# EAGLE schematic Sim7600 interface (EAGLE 9.6.2)
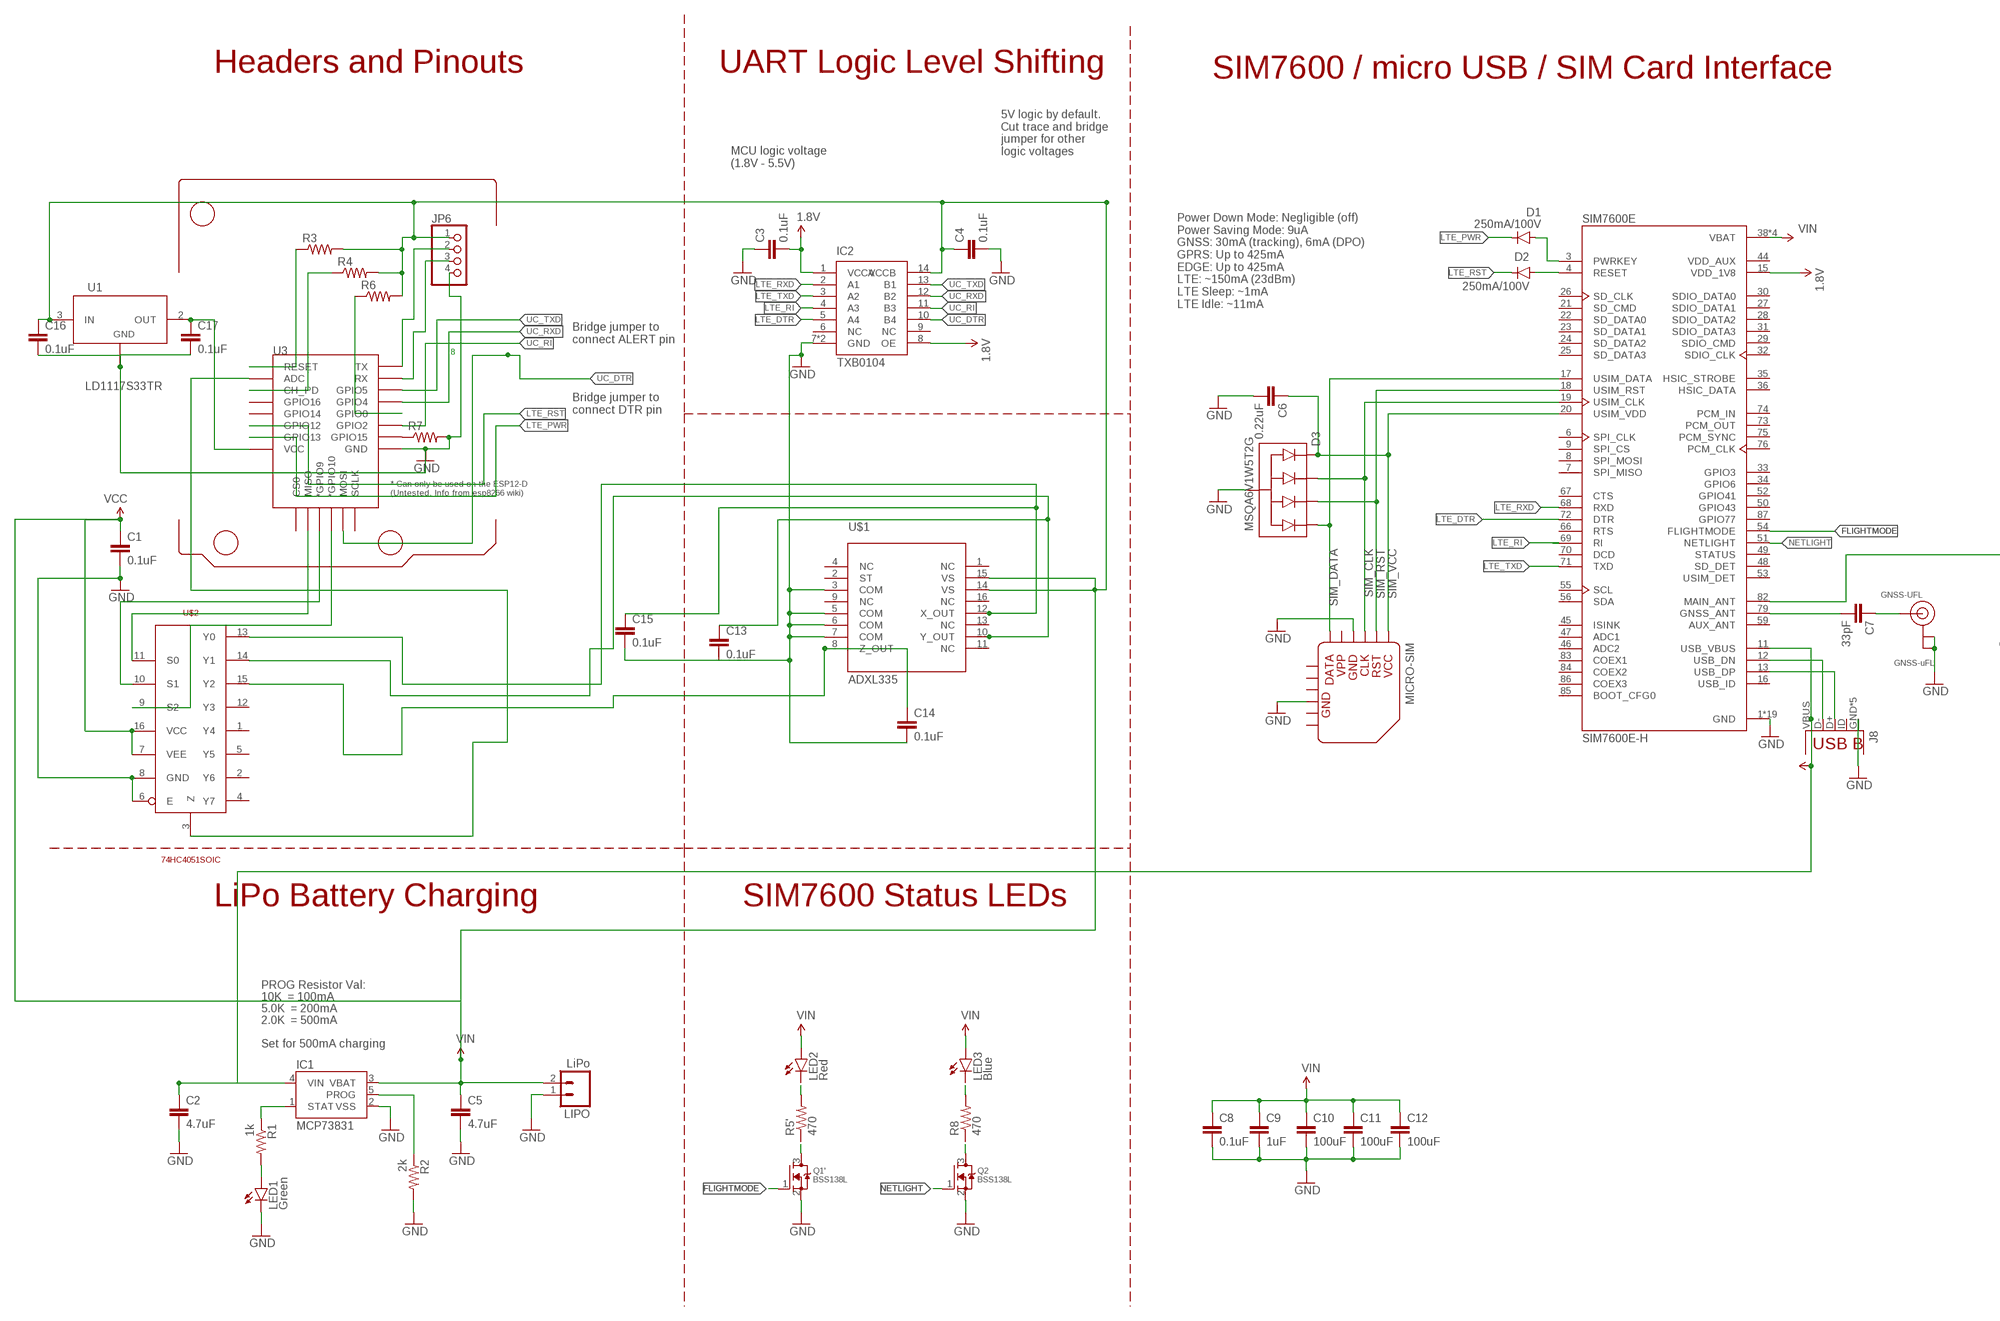
[diagram p0: schematic, sheet 1, part 1 of 2]
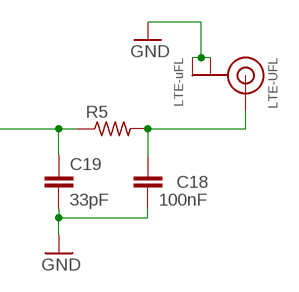
[diagram p1: schematic, sheet 1, part 2 of 2]

## Parts
C1  0.1uF  0.1UF-0603-25V-(+80/-20%)  [0603]
C2  4.7uF  CAPMARKED-0603  [0603-CAP-MARKED]
C3  0.1uF  CAPMARKED-0603  [0603-CAP-MARKED]
C4  0.1uF  CAPMARKED-0603  [0603-CAP-MARKED]
C5  4.7uF  CAPMARKED-0603  [0603-CAP-MARKED]
C6  0.22uF  CAPMARKED-0603  [0603-CAP-MARKED]
C7  33pF  CAPMARKED-0603  [0603-CAP-MARKED]
C8  0.1uF  CAPMARKED-0603  [0603-CAP-MARKED]
C9  1uF  CAPMARKED-0603  [0603-CAP-MARKED]
C10  100uF  CAPMARKED-1210  [1210]
C11  100uF  CAPMARKED-1210  [1210]
C12  100uF  CAPMARKED-1210  [1210]
C13  0.1uF  CAPMARKED-0603  [0603-CAP-MARKED]
C14  0.1uF  CAPMARKED-0603  [0603-CAP-MARKED]
C15  0.1uF  CAPMARKED-0603  [0603-CAP-MARKED]
C16  0.1uF  0.1UF-0603-25V-(+80/-20%)  [0603]
C17  0.1uF  0.1UF-0603-25V-(+80/-20%)  [0603]
C18  100nF  CAPMARKED-0603  [0603-CAP-MARKED]
C19  33pF  CAPMARKED-0603  [0603-CAP-MARKED]
D1  250mA/100V  DIODESOD323  [SOD-323]
D2  250mA/100V  DIODESOD323  [SOD-323]
D3  MSQA6V1W5T2G  TVS-DIODE-ARRAY-4X  [SOT-353]
GNSS-UFL  GNSS-uFL  ANTENNA_U.FL  [U.FL]
IC1  MCP73831  [SOT23-5]
IC2  TXB0104  LEVEL_SHIFTER_TXB0104TXB0104RGYR  [VQFN-14]
J8  microUSB  MICRO-USB_SMD_NOSHIELDV1  [USB-B-MICRO-SMD]
JP6  PINHD-1X4  [1X04]
LED1  Green  LED0603-MARKED  [LED-0603-MARKED]
LED2  Red  LED0603-MARKED  [LED-0603-MARKED]
LED3  Blue  LED0603-MARKED  [LED-0603-MARKED]
LIPO  LiPo  M02-JST-2MM-SMT  [JST-2-SMD]
LTE-UFL  LTE-uFL  ANTENNA_U.FL  [U.FL]
MICRO-SIM  MICROSIM_SOCKET_PUSH-PULL  [MICROSIM_SOCKET_PUSH-PULL]
Q1'  BSS138L  MOSFET-NGENERIC  [SOT23-3]
Q2  BSS138L  MOSFET-NGENERIC  [SOT23-3]
R1  1k  RESISTORMARKED-0603  [0603-RES-MARKED]
R2  2k  RESISTORMARKED-0603  [0603-RES-MARKED]
R3  R-US_R0603  [R0603]
R4  R-US_R0603  [R0603]
R5  10R  R-US_R0603  [R0603]
R5'  470  RESISTORMARKED-0603  [0603-RES-MARKED]
R6  R-US_R0603  [R0603]
R7  R-US_R0603  [R0603]
R8  470  RESISTORMARKED-0603  [0603-RES-MARKED]
SIM7600E  SIM7600E-H  [IC_SIM7600E-H]
U1  LD1117S33TR  [SOT-223]
U3  ESP12ESMD  [ESP12E-SMD]
U$1  ADXL335  [LFCSP16]
U$2  74HC4051SOIC  [SOIC-16_3.9MM]

## Nets
1.8V: C3.2 IC2.1(VCCA) IC2.8(OE) SIM7600E.15(VDD_1V8)
FLIGHTMODE: Q1'.1(G) SIM7600E.54(FLIGHTMODE)
GND: C1.2 C2.2 C3.1 C4.2 C5.2 C6.2 C8.2 C9.2 C10.2 C11.2 C12.2 C13.2 C14.2 C15.2 C16.2 C17.2 C18.2 C19.2 D3.2(COM) GNSS-UFL.1(GND) GNSS-UFL.2(GND) IC1.2(VSS) IC2.7(GND) IC2.PAD(GND) J8.GND J8.SHIELD1(GND) J8.SHIELD2(GND) J8.SHIELD3(GND) J8.SHIELD4(GND) JP6.4 LED1.C LIPO.1 LTE-UFL.1(GND) LTE-UFL.2(GND) MICRO-SIM.C5 MICRO-SIM.GND@4(GND) Q1'.2(S) Q2.2(S) R2.2 R7.2 SIM7600E.1(GND) SIM7600E.2(GND) SIM7600E.5(GND) SIM7600E.10(GND) SIM7600E.14(GND) SIM7600E.37(GND) SIM7600E.40(GND) SIM7600E.41(GND) SIM7600E.43(GND) SIM7600E.57(GND) SIM7600E.58(GND) SIM7600E.60(GND) SIM7600E.61(GND) SIM7600E.64(GND) SIM7600E.65(GND) SIM7600E.77(GND) SIM7600E.78(GND) SIM7600E.80(GND) SIM7600E.81(GND) U1.1(ADJ/GND) U3.GND U$1.3(COM) U$1.5(COM) U$1.6(COM) U$1.7(COM) U$2.6(E) U$2.8(GND)
LTE_DTR: IC2.5(A4) SIM7600E.72(DTR)
LTE_PWR: D1.C U3.GPIO13
LTE_RI: IC2.4(A3) SIM7600E.69(RI)
LTE_RST: D2.C U3.GPIO12
LTE_RXD: IC2.2(A1) SIM7600E.68(RXD)
LTE_TXD: IC2.3(A2) SIM7600E.71(TXD)
MINANT: C19.1 R5.1 SIM7600E.82(MAIN_ANT)
N$1: C7.2 SIM7600E.79(GNSS_ANT)
N$2: D1.A SIM7600E.3(PWRKEY)
N$3: C7.1 GNSS-UFL.3(SIGNAL)
N$4: U3.MISO U$2.11(S0)
N$5: U3.GPIO9(*GPIO9) U$2.10(S1)
N$6: R7.1 U3.GPIO15
N$8: Q1'.3(D) R5'.1
N$10: Q2.3(D) R8.1
N$11: LED3.C R8.2
N$12: U3.GPIO10(*GPIO10) U$2.9(S2)
N$13: R3.1 U3.RESET
N$14: LED1.A R1.2
N$15: R4.1 U3.CH_PD
N$16: C14.1 U$1.8(Z_OUT) U$2.15(Y2)
N$17: C17.1 U1.2(OUT) U1.4 U3.VCC
N$18: R6.1 U3.GPIO0
N$19: J8.D- SIM7600E.12(USB_DN)
N$20: C13.1 U$1.10(Y_OUT) U$2.14(Y1)
N$21: C15.1 U$1.12(X_OUT) U$2.13(Y0)
N$22: J8.D+ SIM7600E.13(USB_DP)
N$23: JP6.2 U3.TXD0(TX)
N$24: JP6.3 U3.RXD0(RX)
N$26: U3.ADC U$2.3(Z)
N$27: LED2.C R5'.2
N$29: C18.1 LTE-UFL.3(SIGNAL) R5.2
NETLIGHT: Q2.1(G) SIM7600E.51(NETLIGHT)
NRESET: D2.A SIM7600E.4(RESET)
PROG: IC1.5(PROG) R2.1
SIM_CLK: D3.3 MICRO-SIM.C3 SIM7600E.19(USIM_CLK)
SIM_DATA: D3.5 MICRO-SIM.C7 SIM7600E.17(USIM_DATA)
SIM_RST: D3.4 MICRO-SIM.C2 SIM7600E.18(USIM_RST)
SIM_VCC: C6.1 D3.1 MICRO-SIM.C1 SIM7600E.20(USIM_VDD)
STAT: IC1.1(STAT) R1.1
UC_DTR: IC2.10(B4) U3.MOSI
UC_RI: IC2.11(B3) U3.GPIO2
UC_RXD: IC2.12(B2) U3.GPIO4
UC_TXD: IC2.13(B1) U3.GPIO5
V_USB: C2.1 IC1.4(VIN) J8.VBUS SIM7600E.11(USB_VBUS)
VIN: C1.1 C4.1 C5.1 C8.1 C9.1 C10.1 C11.1 C12.1 C16.1 IC1.3(VBAT) IC2.14(VCCB) JP6.1 LED2.A LED3.A LIPO.2 R3.2 R4.2 R6.2 SIM7600E.38(VBAT) SIM7600E.39(VBAT) SIM7600E.62(VBAT) SIM7600E.63(VBAT) U1.3(IN) U$1.14(VS) U$1.15(VS) U$2.7(VEE) U$2.16(VCC) ; supply symbol labelled VCC
Unconnected: IC2.6(NC) IC2.9(NC) J8.ID(USBID) MICRO-SIM.C6 SIM7600E.6(SPI_CLK) SIM7600E.7(SPI_MISO) SIM7600E.8(SPI_MOSI) SIM7600E.9(SPI_CS) SIM7600E.16(USB_ID) SIM7600E.21(SD_CMD) SIM7600E.22(SD_DATA0) SIM7600E.23(SD_DATA1) SIM7600E.24(SD_DATA2) SIM7600E.25(SD_DATA3) SIM7600E.26(SD_CLK) SIM7600E.27(SDIO_DATA1) SIM7600E.28(SDIO_DATA2) SIM7600E.29(SDIO_CMD) SIM7600E.30(SDIO_DATA0) SIM7600E.31(SDIO_DATA3) SIM7600E.32(SDIO_CLK) SIM7600E.33(GPIO3) SIM7600E.34(GPIO6) SIM7600E.35(HSIC_STROBE) SIM7600E.36(HSIC_DATA) SIM7600E.44(VDD_AUX) SIM7600E.45(ISINK) SIM7600E.46(ADC2) SIM7600E.47(ADC1) SIM7600E.48(SD_DET) SIM7600E.49(STATUS) SIM7600E.50(GPIO43) SIM7600E.52(GPIO41) SIM7600E.53(USIM_DET) SIM7600E.55(SCL) SIM7600E.56(SDA) SIM7600E.59(AUX_ANT) SIM7600E.66(RTS) SIM7600E.67(CTS) SIM7600E.70(DCD) SIM7600E.73(PCM_OUT) SIM7600E.74(PCM_IN) SIM7600E.75(PCM_SYNC) SIM7600E.76(PCM_CLK) SIM7600E.83(COEX1) SIM7600E.84(COEX2) SIM7600E.85(BOOT_CFG0) SIM7600E.86(COEX3) SIM7600E.87(GPIO77) U3.CS0 U3.GPIO14 U3.GPIO16 U3.SCLK U$1.1(NC) U$1.2(ST) U$1.4(NC) U$1.9(NC) U$1.11(NC) U$1.13(NC) U$1.16(NC) U$2.1(Y4) U$2.2(Y6) U$2.4(Y7) U$2.5(Y5) U$2.12(Y3)

## Notes on the sheet
- Headers and Pinouts | UART Logic Level Shifting | SIM7600 / micro USB / SIM Card Interface
- 5V logic by default.
  Cut trace and bridge
  jumper for other
  logic voltages
- MCU logic voltage
  (1.8V - 5.5V)
- Power Down Mode: Negligible (off)
  Power Saving Mode: 9uA
  GNSS: 30mA (tracking), 6mA (DPO)
  GPRS: Up to 425mA
  EDGE: Up to 425mA
  LTE: ~150mA (23dBm)
  LTE Sleep: ~1mA
  LTE Idle: ~11mA
- Bridge jumper to
  connect ALERT pin
- 8
- Bridge jumper to
  connect DTR pin
- LiPo Battery Charging | SIM7600 Status LEDs
- PROG Resistor Val:
- 10K  = 100mA
- 5.0K  = 200mA
- 2.0K  = 500mA
- Set for 500mA charging

## Power pins joined to a net without a drawn wire
GND: MICRO-SIM.GND@1(GND) MICRO-SIM.GND@2(GND) MICRO-SIM.GND@3(GND) MICRO-SIM.GND@5(GND) MICRO-SIM.GND@6(GND)

## Library data of the parts
C1 C16 C17 = SparkFun-Capacitors:0.1UF: 0.1µF ceramic capacitors A capacitor is a passive two-terminal electrical component used to store electrical energy temporarily in an electric field.; PROD_ID: CAP-00810
C2-C15 C18 C19 = TimWoo-Capacitors:CAP: Capacitor Standard 0603 ceramic capacitor, and 0.1" leaded capacitor.
D1 D2 = TimWoo-Diodes:DIODE: Diode These are standard reverse protection diodes and small signal diodes. SMA package can handle up to about 1A. SOD-323 can handle about 200mA. What the SOD-323 package when ordering, there are some mfgs out there that are 5-pin packages.; PROD_ID: DIO-09646
D3 = TimWoo-Diodes:TVS-DIODE-ARRAY-4X
GNSS-UFL LTE-UFL = TimWoo-Connectors:ANTENNA_U.FL: U.FL Antenna Connector
IC1 = TimWoo-IC:MCP73831: Miniature single cell, fully integrated Li-Ion, Li-polymer charge management controller http://ww1.microchip.com/downloads/en/DeviceDoc/20001984g.pdf IC-09995; PROD_ID: IC-09995
IC2 = TimWoo-IC:LEVEL_SHIFTER_TXB0104
J8 = TimWoo-Connectors:MICRO-USB_SMD_NOSHIELD
JP6 = pinhead:PINHD-1X4: PIN HEADER
LED1-LED3 = TimWoo-LED:LED: LEDs Standard schematic elements and footprints for 5mm, 3mm, 1206, and 0603 sized LEDs. 5mm - Spark Fun Electronics SKU : COM-00529 (and others)
LIPO = TimWoo-Connectors:M02: Standard 2-pin 0.1" header. Use with - straight break away headers ( PRT-00116) - right angle break away headers (PRT-00553) - swiss pins (PRT-00743) - machine pins (PRT-00117) - female headers (PRT-00115) Molex polarized connector foot print use with: PRT-08233 with associated crimp pins and housings. 2.54_SCREWTERM for use with PRT-10571. 3.5mm Screw Terminal footprints for PRT-08084 5mm Screw Terminal footprints for use with PRT-08432; PROD_ID: CONN-11443
MICRO-SIM = TimWoo-Connectors:MICROSIM_SOCKET_PUSH-PULL: https://www.digikey.com/product-detail/en/molex-llc/0786463001/WM9364CT-ND/3770350
Q1' Q2 = TimWoo-MOSFETs:MOSFET-N: N-Channel Mosfet DMG2302UK - 20V 2.8A SOT23 [Digikey: DMG2302UK-7DICT-ND] 2N7002E - 60V 260mA SOT23 [Digikey: 2N7002ET1GOSTR-ND] - REEL BSH103 - 30V 850mA SOT23 [Digikey: 568-5013-1-ND]
R1 R2 R5' R8 = TimWoo-Resistors:RESISTOR: Resistor Basic schematic elements and footprints for 0603, 1206, and PTH resistors.
R3-R7 = resistor:R-US_: RESISTOR, American symbol
SIM7600E = SIM7600E-H:SIM7600E-H: Multi-Band LTE-TDD/LTE-FDD/HSPA+ and GSM/GPRS/EDGE module; AVAILABILITY: Unavailable; DESCRIPTION: Multi-Band LTE-TDD/LTE-FDD/HSPA+ and GSM/GPRS/EDGE module; MF: Simcom; MP: SIM7600E-H; PACKAGE: None; PRICE: None
U1 = IC:LD1117S33TR: IC REG LINEAR 3.3V 800MA SOT223 Manufacturer's datasheet <http://www.st.com/content/ccc/resource/technical/document/datasheet/99/3b/7d/91/91/51/4b/be/CD00000544.pdf/files/CD00000544.pdf/jcr:content/translations/en.CD00000544.pdf>; CREATED_BY: PCBLayout.com; DIGIKEY_PART_NUMBER: 497-1242-2-ND; MANUFACTURER: STMicroelectronics; MPN: LD1117S33TR; PACKAGE: SOT-223
U3 = esp8266modules:ESP12E: ESP12E Module
U$1 = adxl335:ADXL335: ADXL335 Package: LFCSP16 Descripton: small, low power, 3-Axis ±3g Accelerometer Author: Braekevelt Wim Student @ KHBO Ostend Mail : braekevelt.wim@telenet.be <mailto:braekevelt.wim@telenet.be?subject=ADXL335 remark>; IC: ADXL335
U$2 = 74HC4051:74HC4051; AVAILABILITY: Unavailable; DESCRIPTION: 1 Circuit IC Switch 8:1 120Ohm 16-SO; MF: MICROSS/On Semiconductor; MP: 74HC4051; PACKAGE: Die Micross; PRICE: None

## Net classes
0 default: width 0.305 mm